# Altium schematic sheet RS232_Module_5V.SchDoc
size OrCAD A
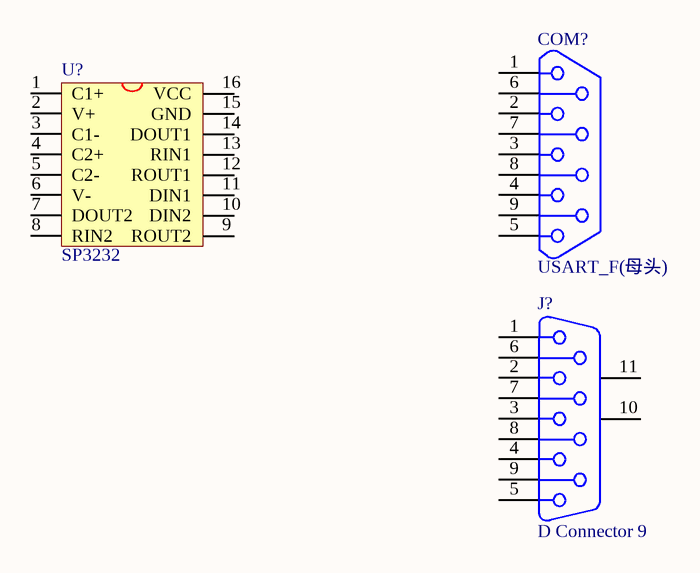
[diagram p0: RS232_Module_5V.SchDoc]

## Parts
COM?  USART_F(母头)  [DB9]
J?  D Connector 9  [DSUB1.385-2H9]
U?  SP3232  [SOP16M]

## Nets

Not connected (* = marked no-connect by the designer): COM? 1 2 3 4 5 6 7 8 9; J? 1 2 3 4 5 6 7 8 9 10(MH1) 11(MH2); U? 1(C1+) 2(V+) 3(C1-) 4(C2+) 5(C2-) 6(V-) 7(DOUT2) 8(RIN2) 9(ROUT2) 10(DIN2) 11(DIN1) 12(ROUT1) 13(RIN1) 14(DOUT1) 15(GND) 16(VCC)

## Notes on the sheet
- Title
- Size:
- Date:
- Orcad A
- Number:
- Time:
- Revision:
- Sheet
- of
- File:

## Library data of the parts
COM? = DB9
J? = D Connector 9: Receptacle Assembly, 9 Position, Right Angle; PackageDocument: O; Positions: 9; Published: 15-Jun-2001; LatestRevisionDate: 17-Jul-2002; LatestRevisionNote: Re-released for DXP Platform.; DatasheetDocument: 1-Sep-1999; PackageReference: 788750; Publisher: Altium Limited; Orientation: Right Angle; Gender: Receptacle
U? = MAX3232